# EAGLE design MOTOR_ (EAGLE 9.6.2)
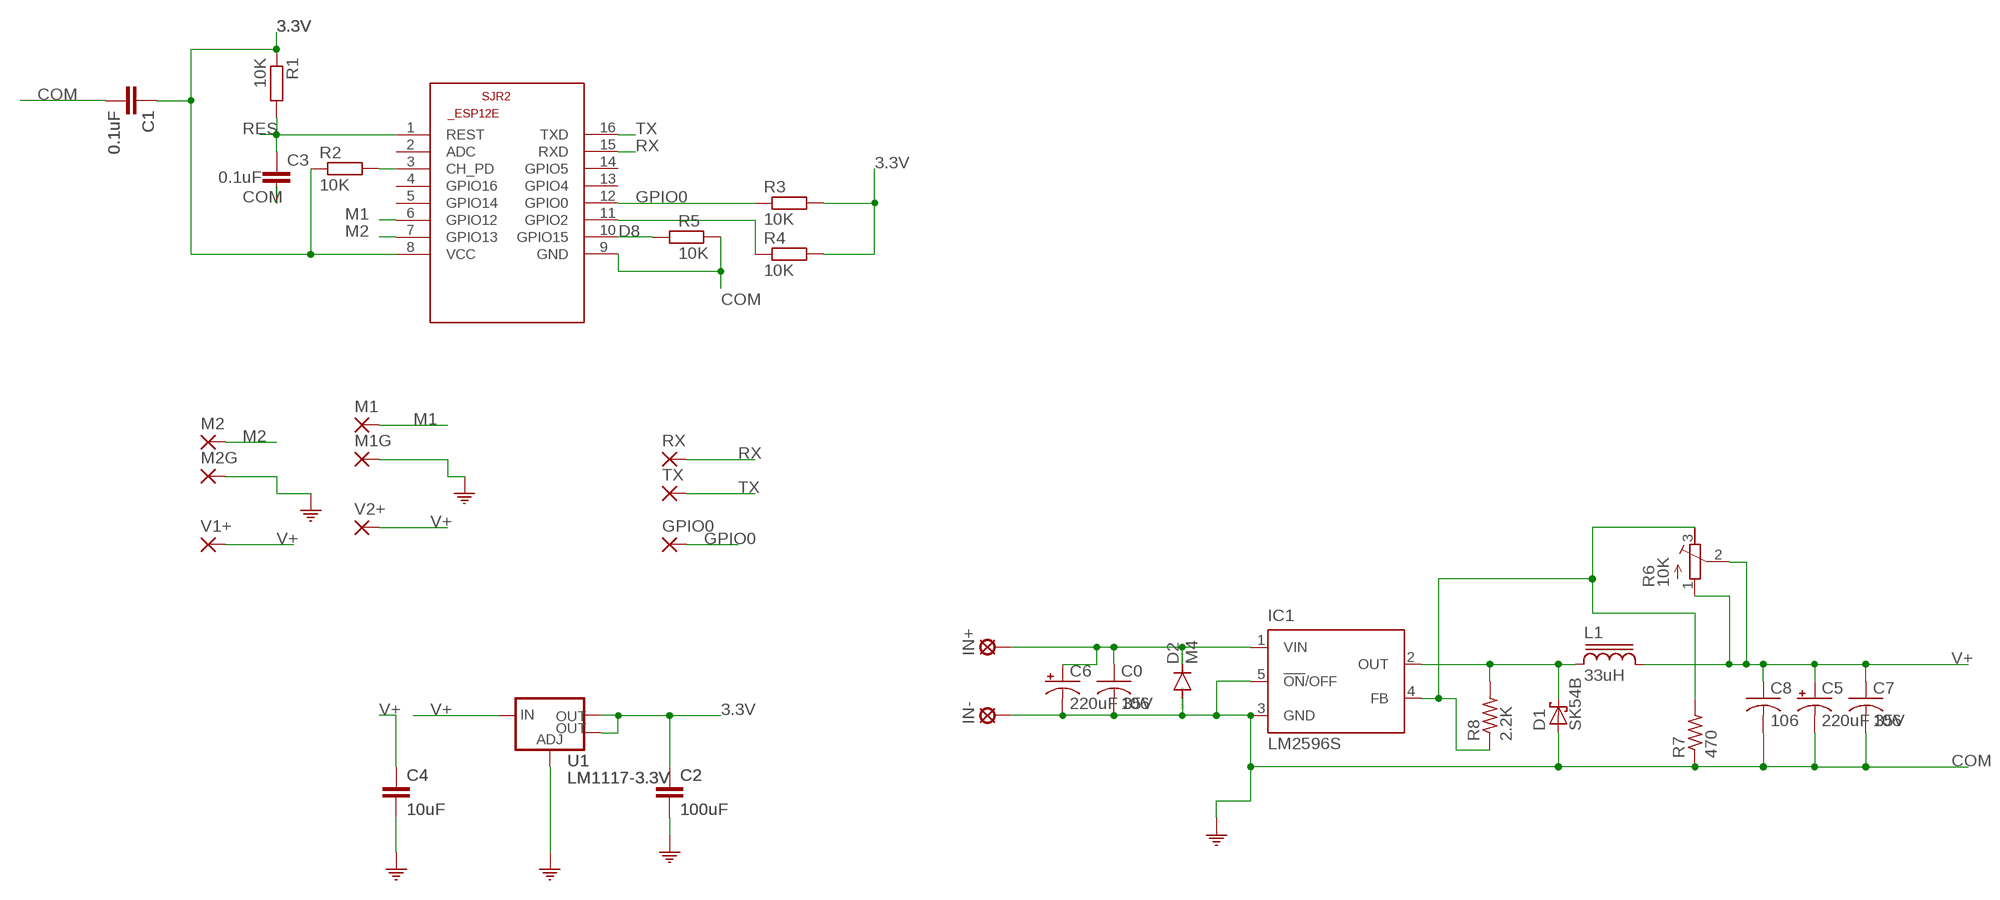
[diagram p0: schematic, sheet 1]

## Parts
C0  106  C-USC1206  [C1206]
C1  0.1uF  C-EUC1206  [C1206]
C2  100uF  C-EUC1206  [C1206]
C3  0.1uF  C-EUC1206  [C1206]
C4  10uF  C-EUC1206  [C1206]
C5  220uF 35V  CPOL-USUD-8X10  [UD-8X10_NICHICON]
C6  220uF 35V  CPOL-USUD-8X10  [UD-8X10_NICHICON]
C7  106  C-USC1206  [C1206]
C8  106  C-USC1206  [C1206]
D1  SK54B  SCHOTTKY-DIODESMD  [SMB]
D2  M4  DIODE-DO214AC  [DO214AC]
GPIO0  SMD2  [SMD1,27-2,54]
IC1  LM2596S  [TO263-5]
IN+  LSP13  [LSP13]
IN-  LSP13  [LSP13]
L1  33uH  CDRH127/LD  [CDRH127/LD]
M1  SMD2  [SMD1,27-2,54]
M1G  SMD2  [SMD1,27-2,54]
M2  SMD2  [SMD1,27-2,54]
M2G  COM  SMD2  [SMD1,27-2,54]
R1  10K  R-EU_R0805  [R0805]
R2  10K  R-EU_R0805  [R0805]
R3  10K  R-EU_R0805  [R0805]
R4  10K  R-EU_R0805  [R0805]
R5  10K  R-EU_R0805  [R0805]
R6  10K  R-TRIMM3296W  [RTRIM3296W]
R7  470  R-US_R1206  [R1206]
R8  2.2K  R-US_R1206  [R1206]
RX  SMD2  [SMD1,27-2,54]
SJR2  ESP8266-12EESP12E  [ESP8266-ESP12E]
TX  SMD2  [SMD1,27-2,54]
U1  LM1117-3.3V  V_REG_LM1117SOT223  [SOT223]
V1+  SMD2  [SMD1,27-2,54]
V2+  SMD2  [SMD1,27-2,54]

## Nets
3.3V: C1.1 C2.1 R1.1 R2.1 R3.2 R4.2 SJR2.8(VCC) U1.2(OUT) U1.4(OUT)
COM: C0.2 C1.2 C2.2 C3.2 C4.2 C5.- C6.- C7.2 C8.2 D1.A D2.A IC1.3(GND) IC1.5(!ON!/OFF) IN-.MP M1G.1(P) M2G.1(P) R5.2 R7.1 SJR2.9(GND) U1.1(ADJ)
D8: R5.1 SJR2.10(GPIO15)
GPIO0: GPIO0.1(P) R3.1 SJR2.12(GPIO0)
M1: M1.1(P) SJR2.6(GPIO12)
M2: M2.1(P) SJR2.7(GPIO13)
N$2: IC1.4(FB) R6.3(E) R7.2 R8.1
N$23: R4.1 SJR2.11(GPIO2)
N$27: R2.2 SJR2.3(CH_PD)
OUT: D1.C IC1.2(OUT) L1.1 R8.2
RES: C3.1 R1.2 SJR2.1(REST)
RX: RX.1(P) SJR2.15(RXD)
TX: SJR2.16(TXD) TX.1(P)
V+: C4.1 C5.+ C7.1 C8.1 L1.2 R6.1(A) R6.2(S) U1.3(IN) V1+.1(P) V2+.1(P)
VIN: C0.1 C6.+ D2.C IC1.1(VIN) IN+.MP
Unconnected: SJR2.2(ADC) SJR2.4(GPIO16) SJR2.5(GPIO14) SJR2.13(GPIO4) SJR2.14(GPIO5)

## Library data of the parts
C0 C7 C8 = rcl:C-US: CAPACITOR, American symbol; SPICEPREFIX: C
C1-C4 = rcl:C-EU: CAPACITOR, European symbol; SPICEPREFIX: C
C5 C6 = rcl:CPOL-US: POLARIZED CAPACITOR, American symbol; SPICEPREFIX: C
D1 = diode:SCHOTTKY-DIODE: Schottky Diode
D2 = diode:DIODE-: DIODE
GPIO0 M1 M1G M2 M2G RX TX V1+ V2+ = wirepad:SMD2: SMD PAD
IC1 = national-semiconductor:LM2596: SIMPLE SWITCHER® Power Converter 150 kHz 3A Step-Down Voltage Regulator Source: http://www.national.com/ds/LM/LM2596.pdf; MF: NATIONAL SEMICONDUCTOR; MPN: LM2596S-ADJ/NOPB; OC_FARNELL: 9494367; OC_NEWARK: 41K3842
IN+ IN- = solpad:LSP13: SOLDER PAD drill 1.3 mm, distributor Buerklin, 12H562
L1 = inductor-sumida:CDRH127/LD: Power Inductor
R1-R5 = resistor:R-EU_: RESISTOR, European symbol
R6 = rcl:R-TRIMM: Trimm resistor; SPICEMODEL: X; SPICEPREFIXL: POT
R7 R8 = rcl:R-US_: RESISTOR, American symbol; SPICEPREFIX: R
SJR2 = esp12e:ESP8266-12E: ESP8266-12E Library for Eagle CAD The author not responsible for any damages or errors!. Created by Suhail jr.lt;/author>
U1 = SparkFun-IC-Power:V_REG_LM1117: Voltage Regulator LM1117 Standard adjustable voltage regulator but in SMD form. Spark Fun Electronics SKU : COM-00595; PROD_ID: VREG-08170

## Board
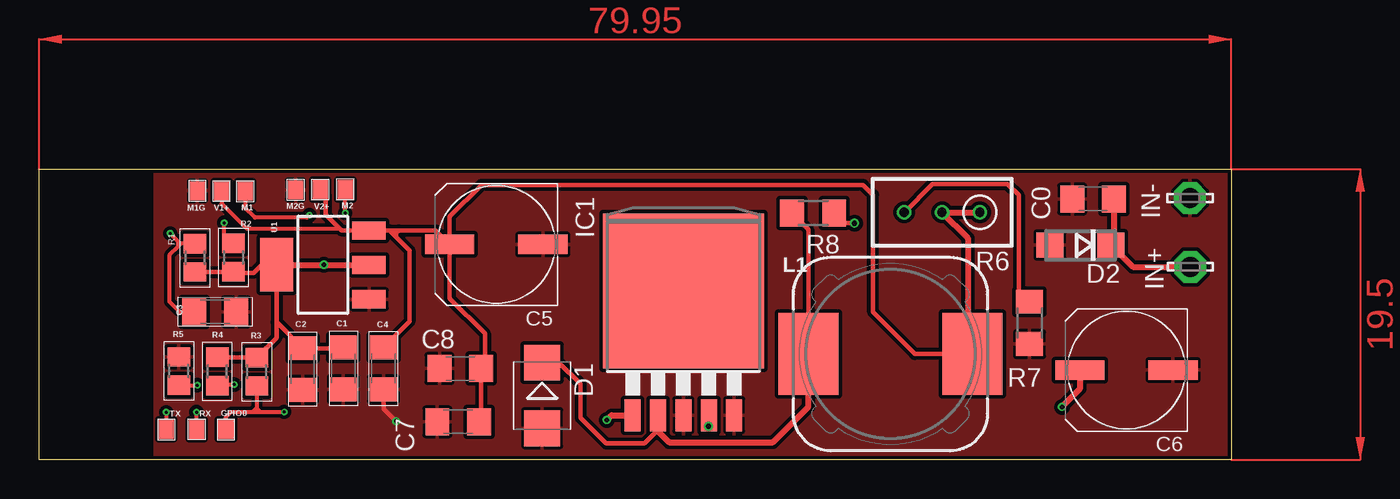
[diagram p1: board, top side]
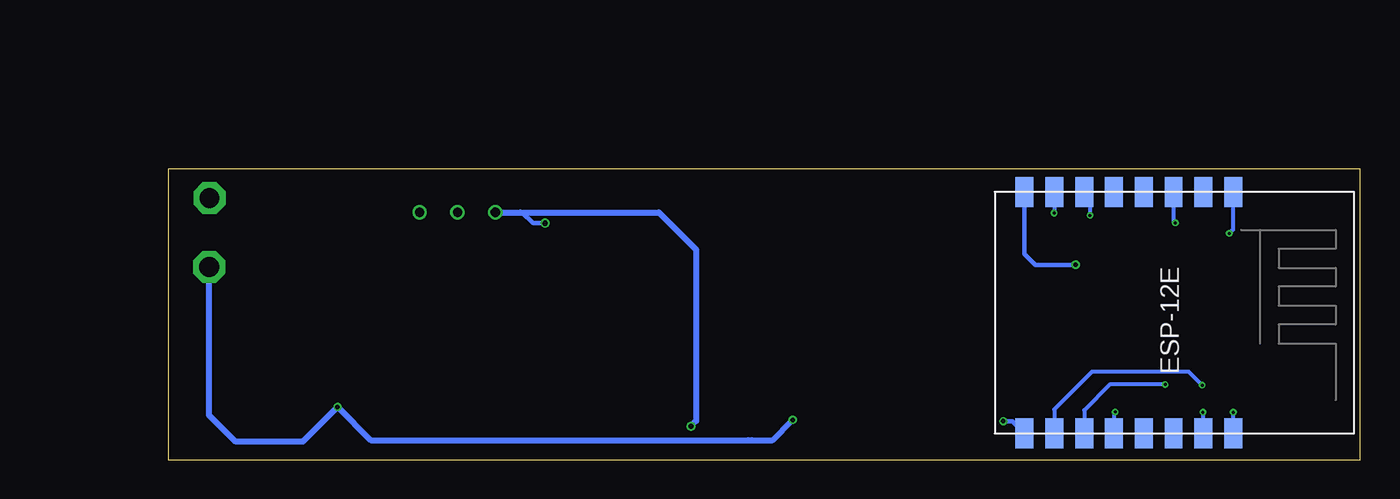
[diagram p2: board, bottom side, seen from below]

Size 79.95 x 19.5 mm. Coordinates in mm from the lower left corner, seen from the top.
Outline: 0,19.5 79.95,19.5 79.95,0 0,0 0,19.5
Copper layers (1*16): Top 0.018mm / dielectric 1.55mm / Bottom 0.018mm
Design rules "default *": minimum track width 0.15mm, minimum drill 0.2mm, track to track 0.15mm, track to pad 0.15mm, pad to pad 0.15mm, via to via 0.15mm, smd to smd 0mil, copper to edge 0.25mm, drill to drill 0.35mm, minimum pad ring 0.175mm, minimum via ring 0.125mm, stop-mask expansion 1mil, vias tented up to drill 0.35mm, thermal gap 0.2mm

### Footprints (pad centres in the part's own frame; a part is rotated, then mirrored left to right if it is on the bottom)
C1206 = smd 1.6 x 1.8: 1 -1.4,0; 2 1.4,0
UD-8X10_NICHICON = smd 3.3 x 1.3: + 3.125,0; - -3.125,0
SMB = smd 2.4 x 2.4: A 2.2,0; C -2.2,0
DO214AC = smd 1.8 x 1.7: A 2.05,0; C -2.05,0
SMD1,27-2,54 = smd 1.016 x 1.27: 1 0,0
TO263-5 = smd 1.067 x 2.159: 1 -3.404,-5.791; 2 -1.702,-5.791; 3 0,-5.791; 4 1.702,-5.791; 5 3.404,-5.791 | smd 10.8 x 10.41: 6 0,2.54
LSP13 = drill 1.321 pad 2.159 octagon: MP 0,0
CDRH127/LD = smd 4 x 5.5: 1 -5.5,0; 2 5.5,0
R0805 = smd 1.3 x 1.5: 1 -0.95,0; 2 0.95,0
RTRIM3296W = drill 0.61: 1 0,-2.54; 2 0,0; 3 0,2.54
R1206 = smd 1.6 x 1.803: 1 -1.422,0; 2 1.422,0
ESP8266-ESP12E = smd 2 x 1.2: 1 -7.62,5.84; 2 -7.62,3.84; 3 -7.62,1.84; 4 -7.62,-0.16; 5 -7.62,-2.16; 6 -7.62,-4.16; 7 -7.62,-6.16; 8 -7.62,-8.16; 9 8.58,-8.16; 10 8.58,-6.16; 11 8.58,-4.16; 12 8.58,-2.16; 13 8.58,-0.16; 14 8.58,1.84; 15 8.58,3.84; 16 8.58,5.84
SOT223 = smd 1.219 x 2.235: 1 -2.311,-3.099; 2 0,-3.099; 3 2.311,-3.099 | smd 3.6 x 2.2: 4 0,3.099

### Placement (x,y rotation side)
C0  70.69,17.5 180 top
C1  20.39,6.12 270 top
C2  17.67,6.08 270 top
C3  11.81,9.92 0 top
C4  23.09,6.12 270 top
C5  30.66,14.45 180 top
C6  72.92,6.02 180 top
C7  28.1,2.54 180 top
C8  28.25,6.12 180 top
D1  33.73,4.31 270 top
D2  69.84,14.41 180 top
GPIO0  12.52,2.02 0 top
IC1  43.21,8.77 0 top
IN+  77.21,12.94 180 top
IN-  77.19,17.56 180 top
L1  57.1,7.09 0 top
M1  13.81,18.02 180 top
M1G  10.61,18.05 180 top
M2  20.53,18.14 180 top
M2G  17.19,18.11 0 top
R1  10.45,13.55 90 top
R2  13.03,13.57 90 top
R3  14.59,5.91 90 top
R4  11.95,5.92 90 top
R5  9.36,5.95 90 top
R6  60.56,16.6 90 top
R7  66.42,9.18 90 top
R8  51.91,16.55 180 top
RX  10.57,2.02 0 top
SJR2  14.36,10.34 270 bottom
TX  8.52,2.02 0 top
U1  19.02,13.08 90 top
V1+  12.23,18.03 180 top
V2+  18.84,18.13 180 top

### Tracks (layer width: path | path; a pad name or v marks a point on that pad's centre or on a via)
3.3V  (via drill 0.3)
  Top 0.305: R1.1 13.01,12.59 | 13.01,12.59 R2.1 | R4.2 14.58,6.88 R3.2 15.92,8.18 15.92,9.23 | C1.1 20.34,7.48 C2.1 15.92,9.23 | 13.01,12.59 13.06,12.55 14.38,12.55 14.91,13.08 U1.4 15.92,9.23
  Top 0.406: U1.4 v19.09,13.08 U1.2
  Bottom 0.305: SJR2.8 22.52,13.8 21.8,13.08 v19.09,13.08
COM  (via drill 0.3)
  Top 0.305: v23.95,2.58 23.09,3.42 C4.2
  Bottom 0.305: SJR2.9 23.34,2.58 v23.95,2.58
  pour Top (isolate 0.25): 7.73,19.4 79.95,19.4 79.95,0.08 7.73,0.08
D8  (via drill 0.2)
  Top 0.254: R5.1 v10.61,5
  Bottom 0.254: v10.61,5 11.51,5.91 17.99,5.91 20.52,3.38 SJR2.10
GPIO0  (via drill 0.2)
  Top 0.254: GPIO0.1 12.52,2.83 12.89,3.2 14.31,3.2 | 14.31,3.2 14.59,3.2 | 14.59,3.2 14.83,3.2 | 14.83,3.2 v16.44,3.2 | R3.1 14.59,3.43 | 14.59,3.43 14.59,3.21 14.59,3.2 | 14.59,3.43 14.83,3.2 | 14.59,3.43 14.53,3.43 14.31,3.2
  Bottom 0.254: v16.44,3.2 16.52,3.12 SJR2.12
M1  (via drill 0.2)
  Top 0.254: v18.12,16.4 17.97,16.24 14.47,16.24 13.81,16.9 M1.1
  Bottom 0.254: SJR2.6 18.12,17.56 v18.12,16.4
M2  (via drill 0.2)
  Top 0.254: v20.53,16.56 M2.1
  Bottom 0.254: SJR2.7 v20.52,16.56 v20.53,16.56
N$2  (via drill 0.35)
  Top 0.305: R6.3 59.91,18.5 64.95,18.5 65.7,17.75 65.7,11.32 R7.2 | R8.1 54,15.87 v54.69,15.87
  Top 0.406: v44.89,2.24 44.89,2.97 IC1.4
  Bottom 0.305: v54.69,15.87 55.48,15.87 56.22,16.6 56.35,16.6
  Bottom 0.406: R6.3 56.35,16.6 47.05,16.6 44.55,14.09 44.55,2.59 v44.89,2.24
N$23  (via drill 0.2)
  Top 0.254: R4.1 12.02,5.04 v13.09,5.04
  Bottom 0.254: v13.09,5.04 16.8,5.04 18.52,3.32 SJR2.11
N$27  (via drill 0.2)
  Top 0.254: R2.2 12.41,15.14 v12.41,15.9
  Bottom 0.254: v12.41,15.9 12.52,16 SJR2.3
OUT
  Top 0.305: D1.C 34.88,6.51 36.31,5.08 36.31,2.8 38.02,1.09 40.59,1.09 41.51,2.01 IC1.2 | R8.2 51.6,15.43 L1.1
  Top 0.406: L1.1 51.6,3.55 49.23,1.18 42.23,1.18 41.51,1.9 IC1.2
RES  (via drill 0.2)
  Top 0.254: R1.2 9.51,14.49 | 9.51,14.49 9.32,14.31 | 9.32,14.31 8.73,13.72 8.73,10.6 9.42,9.92 C3.1 | v8.78,15.19 9.32,14.65 | 9.32,14.65 9.48,14.49 9.51,14.49 | 9.32,14.31 9.32,14.65
  Bottom 0.254: SJR2.1 8.53,17.94 8.53,15.44 v8.78,15.19
RX  (via drill 0.2)
  Top 0.254: RX.1 10.57,3.17 v10.55,3.19
  Bottom 0.254: v10.55,3.19 10.55,1.79 SJR2.15
TX  (via drill 0.2)
  Top 0.254: v8.51,3.19 8.52,3.17 TX.1
  Bottom 0.254: SJR2.16 8.52,3.17 v8.51,3.19
V+
  Top 0.254: V1+.1 12.23,17.19 13.9,15.52 20.14,15.52
  Top 0.305: U1.3 23.5,15.39 23.93,14.96 | 23.93,14.96 24.84,14.05 24.84,9.27 C4.1 | U1.3 24.12,15.39 | 24.12,15.39 26.59,15.39 C5.+ | 23.93,14.96 23.93,15.2 24.12,15.39 | V2+.1 19.23,17.75 19.23,16.44 20.14,15.52 20.27,15.39 U1.3 | C5.+ 27.53,16.31 29.67,18.44 55.26,18.44 55.92,17.78 55.92,9.9 58.73,7.09 62.29,7.09 L1.2 | C5.+ 27.53,10.83 29.89,8.46 29.89,6.37 C8.1 29.64,2.69 C7.1
  Top 0.406: R6.1 R6.2 62.29,14.87 62.29,7.09
VIN  (via drill 0.3)
  Top 0.406: C6.+ 69.8,4.73 v68.6,3.53 | IN+.MP 73.36,12.94 D2.C 72.09,14.6 C0.1 | v38.07,2.66 38.39,2.98 IC1.1
  Bottom 0.406: IN+.MP 77.21,2.99 75.42,1.2 70.93,1.2 v68.6,3.53 66.37,1.31 41.04,1.31 40.83,1.31 39.42,1.31 v38.07,2.66
(copper drawn outside any net)
  shapes: Top area x2